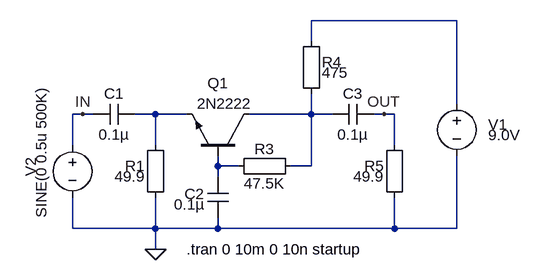
[diagram p0: schematic rf_preamp.asc]
rf_preamp.asc, the LTspice schematic file:
Version 4
SHEET 1 2412 680
WIRE 240 -1120 16 -1120
WIRE 16 -1088 16 -1120
WIRE 240 -992 240 -1120
WIRE -336 -976 -352 -976
WIRE -320 -976 -336 -976
WIRE -224 -976 -256 -976
WIRE -176 -976 -224 -976
WIRE 16 -976 16 -1008
WIRE 16 -976 -80 -976
WIRE 48 -976 16 -976
WIRE 128 -976 112 -976
WIRE 144 -976 128 -976
WIRE -352 -928 -352 -976
WIRE -224 -928 -224 -976
WIRE 144 -928 144 -976
WIRE -128 -896 -128 -912
WIRE -96 -896 -128 -896
WIRE 16 -896 16 -976
WIRE 16 -896 -16 -896
WIRE -128 -880 -128 -896
WIRE -352 -800 -352 -848
WIRE -224 -800 -224 -848
WIRE -224 -800 -352 -800
WIRE -128 -800 -128 -816
WIRE -128 -800 -224 -800
WIRE 144 -800 144 -848
WIRE 144 -800 -128 -800
WIRE 240 -800 240 -912
WIRE 240 -800 144 -800
WIRE -224 -768 -224 -800
FLAG -224 -768 0
FLAG -336 -976 IN
FLAG 128 -976 OUT
SYMBOL voltage 240 -1008 R0
WINDOW 0 48 48 Left 2
WINDOW 3 48 64 Left 2
WINDOW 123 0 0 Left 2
WINDOW 39 0 0 Left 2
SYMATTR InstName V1
SYMATTR Value 9.0V
SYMBOL cap -320 -960 R270
WINDOW 0 32 32 VTop 2
WINDOW 3 0 32 VBottom 2
SYMATTR InstName C1
SYMATTR Value 0.1µ
SYMATTR SpiceLine V=10 Irms=728m Rser=0.14361 Lser=0 mfg="KEMET" pn="C0603C104K8RAC" type="X7R"
SYMBOL Misc\\EuropeanResistor -208 -832 R180
WINDOW 0 32 64 Left 2
WINDOW 3 32 48 Left 2
SYMATTR InstName R1
SYMATTR Value 49.9
SYMATTR SpiceLine tol=1 pwr=0.1
SYMBOL npn -80 -912 M270
WINDOW 0 112 64 VLeft 2
WINDOW 3 80 80 VLeft 2
SYMATTR InstName Q1
SYMATTR Value 2N2222
SYMBOL Misc\\EuropeanResistor 0 -912 R90
WINDOW 0 5 56 VBottom 2
WINDOW 3 27 56 VTop 2
SYMATTR InstName R3
SYMATTR Value 47.5K
SYMATTR SpiceLine tol=1 pwr=0.1
SYMBOL cap -112 -816 R180
WINDOW 0 37 37 Left 2
WINDOW 3 36 21 Left 2
SYMATTR InstName C2
SYMATTR Value 0.1µ
SYMATTR SpiceLine V=10 Irms=1.34 Rser=0.0989014 Lser=0 mfg="KEMET" pn="C0805C104K8RAC" type="X7R"
SYMBOL cap 48 -960 R270
WINDOW 0 32 32 VTop 2
WINDOW 3 0 32 VBottom 2
SYMATTR InstName C3
SYMATTR Value 0.1µ
SYMATTR SpiceLine V=10 Irms=728m Rser=0.14361 Lser=0 mfg="KEMET" pn="C0603C104K8RAC" type="X7R"
SYMBOL Misc\\EuropeanResistor 0 -1104 R0
WINDOW 0 32 48 Left 2
WINDOW 3 32 64 Left 2
SYMATTR InstName R4
SYMATTR Value 475
SYMATTR SpiceLine tol=1 pwr=0.1
SYMBOL Misc\\EuropeanResistor 128 -944 R0
WINDOW 0 0 48 Right 2
WINDOW 3 0 64 Right 2
SYMATTR InstName R5
SYMATTR Value 49.9
SYMATTR SpiceLine tol=1 pwr=0.1
SYMBOL voltage -352 -944 R0
WINDOW 0 -64 64 VLeft 2
WINDOW 3 -48 128 VLeft 2
WINDOW 123 0 0 Left 2
WINDOW 39 0 0 Left 2
SYMATTR InstName V2
SYMATTR Value SINE(0 0.5u 500K)
TEXT -176 -768 Left 2 !.tran 0 10m 0 10n startup

The netlist it stands for:
* rf_preamp.asc
V1 N001 0 9.0V
C1 IN N002 0.1µ V=10 Irms=728m Rser=0.14361 Lser=0 mfg="KEMET" pn="C0603C104K8RAC" type="X7R"
R1 0 N002 49.9 tol=1 pwr=0.1
Q1 N003 N004 N002 0 2N2222
R3 N003 N004 47.5K tol=1 pwr=0.1
C2 0 N004 0.1µ V=10 Irms=1.34 Rser=0.0989014 Lser=0 mfg="KEMET" pn="C0805C104K8RAC" type="X7R"
C3 N003 OUT 0.1µ V=10 Irms=728m Rser=0.14361 Lser=0 mfg="KEMET" pn="C0603C104K8RAC" type="X7R"
R4 N001 N003 475 tol=1 pwr=0.1
R5 OUT 0 49.9 tol=1 pwr=0.1
V2 IN 0 SINE(0 0.5u 500K)
.model NPN NPN
.model PNP PNP
.lib standard.bjt
.tran 0 10m 0 10n startup
.backanno
.end